# EAGLE design Dario - Rev A1 (EAGLE 7.6.0)
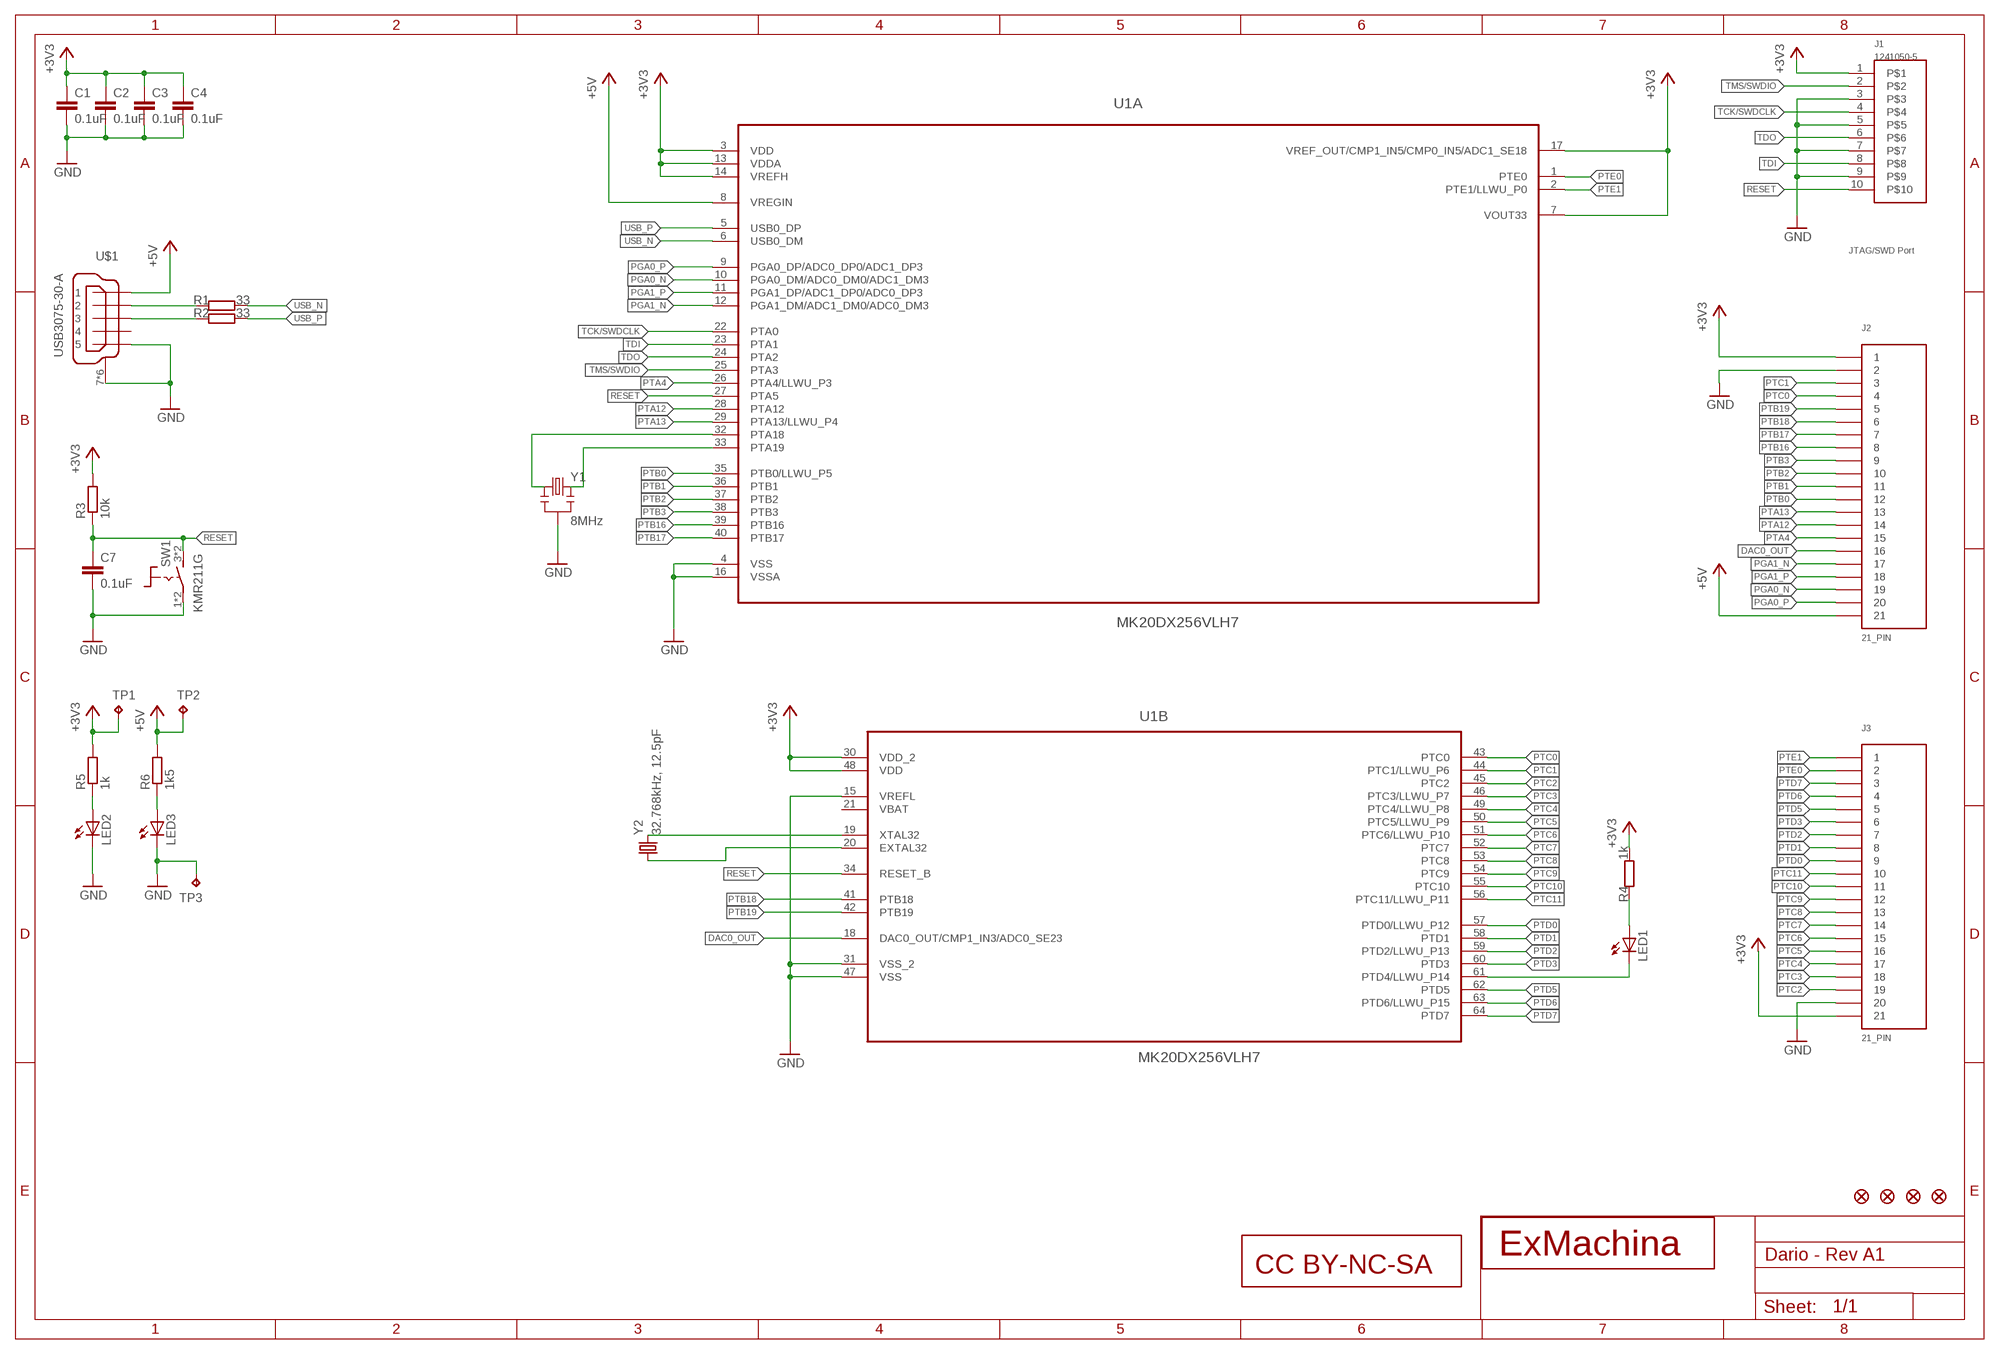
[diagram p0: schematic, sheet 1]

## Parts
C1  0.1uF  C-EUC0603  [C0603]
C2  0.1uF  C-EUC0603  [C0603]
C3  0.1uF  C-EUC0603  [C0603]
C4  0.1uF  C-EUC0603  [C0603]
C7  0.1uF  C-EUC0603  [C0603]
J1  1241050-5  [2.54/2X5]
J2  21_PIN  [21_CUSTOM]
J3  21_PIN  [21_CUSTOM]
JP1  FIDUCIAL1X2  [FIDUCIAL-1X2]
JP2  FIDUCIAL1X2  [FIDUCIAL-1X2]
JP3  FIDUCIAL1X2  [FIDUCIAL-1X2]
JP4  FIDUCIAL1X2  [FIDUCIAL-1X2]
LED1  LEDCHIP-LED0603  [CHIP-LED0603]
LED2  LEDCHIP-LED0603  [CHIP-LED0603]
LED3  LEDCHIP-LED0603  [CHIP-LED0603]
R1  33  R-EU_R0603  [R0603]
R2  33  R-EU_R0603  [R0603]
R3  10k  R-EU_R0603  [R0603]
R4  1k  R-EU_R0603  [R0603]
R5  1k  R-EU_R0603  [R0603]
R6  1k5  R-EU_R0603  [R0603]
SW1  KMR211G  [KM_SERIE]
TP1  TPB1,27  [B1,27]
TP2  TPB1,27  [B1,27]
TP3  TPB1,27  [B1,27]
U1  MK20DX256VLH7  [QFP50P1200X1200X160-64N]
U$1  USB3075-30-A  [USB_MICROB_SMT]
U$3  EXMACHINA-LOGO-NAME  [EXM-LOGO-BASELINE]
U$4  CC-BY-NC-SA  [CC-BY-NC-SA]
Y1  8MHz  RESONATORSMD  [RESONATOR-SMD]
Y2  32.768kHz, 12.5pF  ABS07-32.768KHZ  [ABS07]

## Nets
+3V3: C1.1 C2.1 C3.1 C4.1 J1.1 J2.P$1 J3.P$21 R3.2 R4.2 R5.2 TP1.TP U1.3(A:VDD) U1.7(A:VOUT33) U1.13(A:VDDA) U1.14(A:VREFH) U1.17(A:VREF_OUT/CMP1_IN5/CMP0_IN5/ADC1_SE18) U1.30(B:VDD_2) U1.48(B:VDD)
+5V: J2.P$21 R6.2 TP2.TP U1.8(A:VREGIN) U$1.1
DAC0_OUT: J2.P$16 U1.18(B:DAC0_OUT/CMP1_IN3/ADC0_SE23)
GND: C1.2 C2.2 C3.2 C4.2 C7.2 J1.3 J1.5 J1.7 J1.9 J2.P$2 J3.P$20 LED2.C LED3.C SW1.1 SW1.2 TP3.TP U1.4(A:VSS) U1.15(B:VREFL) U1.16(A:VSSA) U1.31(B:VSS_2) U1.47(B:VSS) U$1.5 U$1.7(S) U$1.8(S) U$1.9(S) U$1.10(S) U$1.11(S) U$1.12(S) Y1.2
N$1: R1.1 U$1.2
N$2: R2.1 U$1.3
N$3: U1.33(A:PTA19) Y1.3
N$4: U1.32(A:PTA18) Y1.1
N$5: U1.19(B:XTAL32) Y2.2
N$6: U1.20(B:EXTAL32) Y2.1
N$7: LED1.C U1.61(B:PTD4/LLWU_P14)
N$8: LED1.A R4.1
N$9: LED3.A R6.1
N$10: LED2.A R5.1
PGA0_N: J2.P$19 U1.10(A:PGA0_DM/ADC0_DM0/ADC1_DM3)
PGA0_P: J2.P$20 U1.9(A:PGA0_DP/ADC0_DP0/ADC1_DP3)
PGA1_N: J2.P$17 U1.12(A:PGA1_DM/ADC1_DM0/ADC0_DM3)
PGA1_P: J2.P$18 U1.11(A:PGA1_DP/ADC1_DP0/ADC0_DP3)
PTA4: J2.P$15 U1.26(A:PTA4/LLWU_P3)
PTA12: J2.P$14 U1.28(A:PTA12)
PTA13: J2.P$13 U1.29(A:PTA13/LLWU_P4)
PTB0: J2.P$12 U1.35(A:PTB0/LLWU_P5)
PTB1: J2.P$11 U1.36(A:PTB1)
PTB2: J2.P$10 U1.37(A:PTB2)
PTB3: J2.P$9 U1.38(A:PTB3)
PTB16: J2.P$8 U1.39(A:PTB16)
PTB17: J2.P$7 U1.40(A:PTB17)
PTB18: J2.P$6 U1.41(B:PTB18)
PTB19: J2.P$5 U1.42(B:PTB19)
PTC0: J2.P$4 U1.43(B:PTC0)
PTC1: J2.P$3 U1.44(B:PTC1/LLWU_P6)
PTC2: J3.P$19 U1.45(B:PTC2)
PTC3: J3.P$18 U1.46(B:PTC3/LLWU_P7)
PTC4: J3.P$17 U1.49(B:PTC4/LLWU_P8)
PTC5: J3.P$16 U1.50(B:PTC5/LLWU_P9)
PTC6: J3.P$15 U1.51(B:PTC6/LLWU_P10)
PTC7: J3.P$14 U1.52(B:PTC7)
PTC8: J3.P$13 U1.53(B:PTC8)
PTC9: J3.P$12 U1.54(B:PTC9)
PTC10: J3.P$11 U1.55(B:PTC10)
PTC11: J3.P$10 U1.56(B:PTC11/LLWU_P11)
PTD0: J3.P$9 U1.57(B:PTD0/LLWU_P12)
PTD1: J3.P$8 U1.58(B:PTD1)
PTD2: J3.P$7 U1.59(B:PTD2/LLWU_P13)
PTD3: J3.P$6 U1.60(B:PTD3)
PTD5: J3.P$5 U1.62(B:PTD5)
PTD6: J3.P$4 U1.63(B:PTD6/LLWU_P15)
PTD7: J3.P$3 U1.64(B:PTD7)
PTE0: J3.P$2 U1.1(A:PTE0)
PTE1: J3.P$1 U1.2(A:PTE1/LLWU_P0)
RESET: C7.1 J1.10 R3.1 SW1.3 SW1.4 U1.27(A:PTA5) U1.34(B:RESET_B)
TCK/SWDCLK: J1.4 U1.22(A:PTA0)
TDI: J1.8 U1.23(A:PTA1)
TDO: J1.6 U1.24(A:PTA2)
TMS/SWDIO: J1.2 U1.25(A:PTA3)
USB_N: R1.2 U1.6(A:USB0_DM)
USB_P: R2.2 U1.5(A:USB0_DP)
Unconnected: U$1.4

## Notes on the sheet
- JTAG/SWD Port

## Power pins joined to a net without a drawn wire
VBAT: U1.21(B:VBAT)

## Library data of the parts
C1-C4 C7 = rcl:C-EU: CAPACITOR, European symbol; MPN: MC0603B104K160CT; OC_NEWARK: 06R4923
J1 = con-amp:1241050-5; MPN: 1241050-5; OC_NEWARK: 98K5467
J2 J3 = con-custom:21_PIN; OC_NEWARK: unknown
JP1-JP4 = SparkFun:FIDUCIAL: Fiducial Alignment Points Various fiducial points for machine vision alignment.; OC_NEWARK: unknown
LED1-LED3 = led:LED: LED OSRAM: - CHIPLED LG R971, LG N971, LY N971, LG Q971, LY Q971, LO R971, LY R971 LH N974, LH R974 LS Q976, LO Q976, LY Q976 LO Q996 - Hyper CHIPLED LW Q18S LB Q993, LB Q99A, LB R99A - SideLED LS A670, LO A670, LY A670, LG A670, LP A670 LB A673, LV A673, LT A673, LW A673 LH A674 LY A675 LS A676, LA A676, LO A676, LY A676, LW A676 LS A679, LY A679, LG A679 - Hyper Micro SIDELED® LS Y876, LA Y876, LO Y876, LY Y876 LT Y87S - SmartLED LW L88C, LW L88S LB L89C, LB L89S, LG L890 LS L89K, LO L89K, LY L89K LS L896, LA L896, LO L896, LY L896 - TOPLED LS T670, LO T670, LY T670, LG T670, LP T670 LSG T670, LSP T670, LSY T670, LOP T670, LYG T670 LG T671, LOG T671, LSG T671 LB T673, LV T673, LT T673, LW T673 LH T674 LS T676, LA T676, LO T676, LY T676, LB T676, LH T676, LSB T676, LW T676 LB T67C, LV T67C, LT T67C, LS T67K, LO T67K, LY T67K, LW E67C LS E67B, LA E67B, LO E67B, LY E67B, LB E67C, LV E67C, LT E67C LW T67C LS T679, LY T679, LG T679 LS T770, LO T770, LY T770, LG T770, LP T770 LB T773, LV T773, LT T773, LW T773 LH T774 LS E675, LA E675, LY E675, LS T675 LS T776, LA T776, LO T776, LY T776, LB T776 LHGB T686 LT T68C, LB T68C - Hyper Mini TOPLED® LB M676 - Mini TOPLED Santana® LG M470 LS M47K, LO M47K, LY M47K Source: http://www.osram.convergy.de LUXEON: - LUMILED® LXK2-PW12-R00, LXK2-PW12-S00, LXK2-PW14-U00, LXK2-PW14-V00 LXK2-PM12-R00, LXK2-PM12-S00, LXK2-PM14-U00 LXK2-PE12-Q00, LXK2-PE12-R00, LXK2-PE12-S00, LXK2-PE14-T00, LXK2-PE14-U00 LXK2-PB12-K00, LXK2-PB12-L00, LXK2-PB12-M00, LXK2-PB14-N00, LXK2-PB14-P00, LXK2-PB14-Q00 LXK2-PR12-L00, LXK2-PR12-M00, LXK2-PR14-Q00, LXK2-PR14-R00 LXK2-PD12-Q00, LXK2-PD12-R00, LXK2-PD12-S00 LXK2-PH12-R00, LXK2-PH12-S00 LXK2-PL12-P00, LXK2-PL12-Q00, LXK2-PL12-R00 Source: www.luxeon.com KINGBRIGHT: KA-3528ASYC Source: www.kingbright.com; OC_NEWARK: unknown
R1 R2 = rcl:R-EU_: RESISTOR, European symbol; MPN: MCMR06X33R0FTL; OC_NEWARK: 86T3614
R3 = rcl:R-EU_: RESISTOR, European symbol; MPN: MCMR06X1002FTL; OC_NEWARK: 86T3506
R4 R5 = rcl:R-EU_: RESISTOR, European symbol; MPN: MCMR06X1001FTL; OC_NEWARK: 86T3505
R6 = rcl:R-EU_: RESISTOR, European symbol; MPN: MCMR06X1501FTL; OC_NEWARK: 86T3542
SW1 = Switch_SMT:KMR211G; MPN: KMR211G LFS; OC_NEWARK: 58M7852
TP1-TP3 = testpad:TP: Test pad; OC_NEWARK: unknown
U1 = freescale:MK20DX256VLH7: MCU, KINETIS, K20, CORTEX M4, LQFP-64; MPN: MK20DX256VLH7; OC_FARNELL: 2133577; OC_NEWARK: 24W6507; PACKAGE: LQFP-64; SUPPLIER: FREESCALE SEMICONDUCTOR
U$1 = con-GlobalConnectorTechnology:USB3075-30-A; MPN: USB3075-30-A; OC_NEWARK: 58T0863
U$3 = exmachina:EXMACHINA-LOGO; OC_NEWARK: unknown
U$4 = cc-by-sa:CC-BY-NC-SA; OC_NEWARK: unknown
Y1 = resonator:RESONATOR: Resonator Small SMD resonator. This is the itty bitty 10/20MHz resonators with built in caps. CSTCE10M0G55 and CSTCE20M0V53. Footprint for SMD has been used in SFE production for years, and does work okay. 1:1 is an attempt to get larger fillets on the sides so it will be easier to inspect these solders in our AOI machine. The pads have been minimized to match the actual metal under the resonator. To see this relation, it includes an image import of the bottom side of the component. Imported to scale on layer 200.; MPN: CSTCE8M00G55Z-R0; OC_NEWARK: 80P4001
Y2 = crystal:ABS07-?; MPN: ABS07-32.768KHZ-1-T; OC_FARNELL: 2101347; OC_NEWARK: 11N6974

## Board
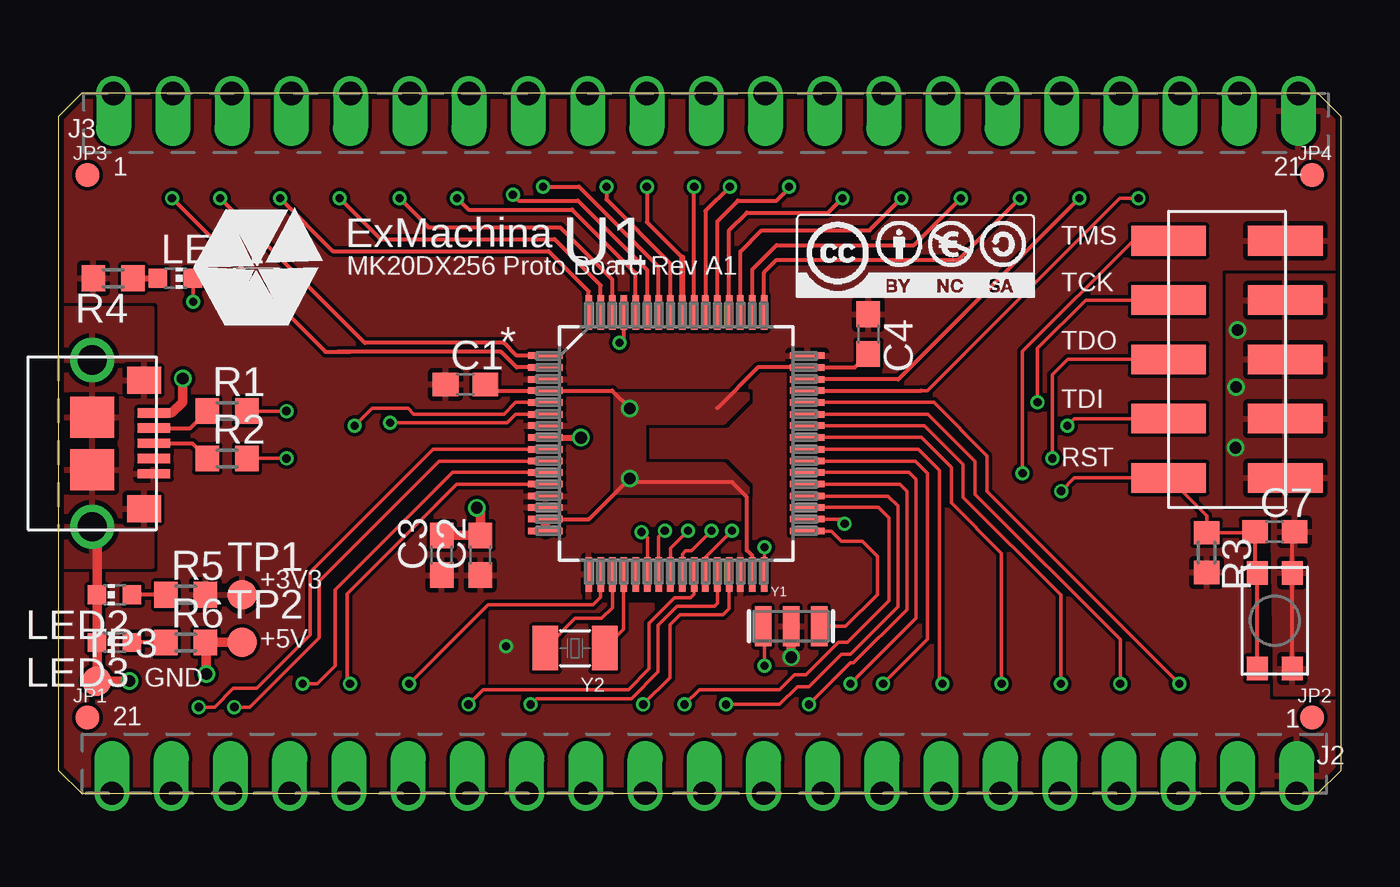
[diagram p1: board, top side]
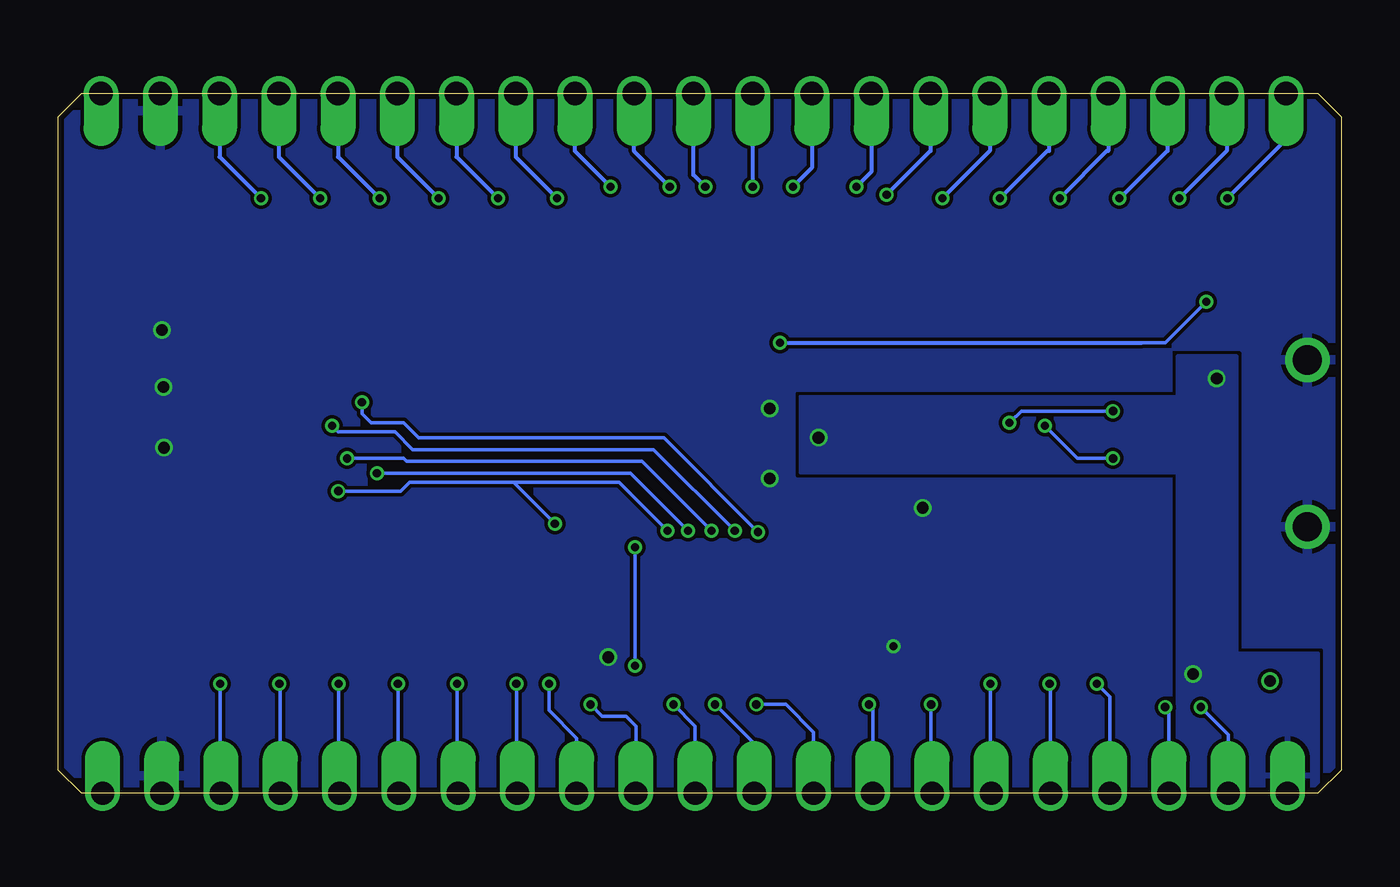
[diagram p2: board, bottom side, seen from below]

Size 55 x 30 mm. Coordinates in mm from the lower left corner, seen from the top.
Outline: 55,1 55,29 54,30 1,30 0,29 0,1 1,0 54,0 55,1
Copper layers (1*16): Top 0.018mm / dielectric 1.55mm / Bottom 0.018mm
Design rules "eC_2Layer_PClass6_BaseCopperO18_eCDefault *": minimum track width 0.15mm, minimum drill 0.35mm, track to track 0.15mm, track to pad 0.15mm, pad to pad 0.15mm, via to via 0.15mm, smd to smd 0mil, copper to edge 0.25mm, drill to drill 0.35mm, minimum pad ring 0.175mm, minimum via ring 0.125mm, stop-mask expansion 0mil, vias tented up to drill 0.45mm, thermal gap 0.2mm

### Footprints (pad centres in the part's own frame; a part is rotated, then mirrored left to right if it is on the bottom)
C0603 = smd 1.1 x 1: 1 -0.85,0; 2 0.85,0
2.54/2X5 = smd 1.27 x 3.2: 1 -5.08,2.5; 2 -5.08,-2.5; 3 -2.54,2.5; 4 -2.54,-2.5; 5 0,2.5; 6 0,-2.5; 7 2.54,2.5; 8 2.54,-2.5; 9 5.08,2.5; 10 5.08,-2.5
21_CUSTOM = drill 1 offset: P$1 -25.4,0; P$2 -22.86,0; P$3 -20.32,0; P$4 -17.78,0; P$5 -15.24,0; P$6 -12.7,0; P$7 -10.16,0; P$8 -7.62,0; P$9 -5.08,0; P$10 -2.54,0; P$11 0,0; P$12 2.54,0; P$13 5.08,0; P$14 7.62,0; P$15 10.16,0; P$16 12.7,0; P$17 15.24,0; P$18 17.78,0; P$19 20.32,0; P$20 22.86,0; P$21 25.4,0
FIDUCIAL-1X2 = smd 1 x 1: 1 0,0
CHIP-LED0603 = smd 0.8 x 0.8: A 0,-0.75; C 0,0.75
R0603 = smd 1 x 1.1: 1 -0.85,0; 2 0.85,0
KM_SERIE = smd 1 x 0.9: 1 -2.05,0.75; 2 2.05,0.75; 3 -2.05,-0.75; 4 2.05,-0.75
B1,27 = smd 1.27 x 1.27: TP 0,0
QFP50P1200X1200X160-64N = smd 1.473 x 0.279: 1 -5.613,3.759; 2 -5.613,3.251; 3 -5.613,2.743; 4 -5.613,2.261; 5 -5.613,1.753; 6 -5.613,1.245; 7 -5.613,0.762; 8 -5.613,0.254; 9 -5.613,-0.254; 10 -5.613,-0.762; 11 -5.613,-1.245; 12 -5.613,-1.753; 13 -5.613,-2.261; 14 -5.613,-2.743; 15 -5.613,-3.251; 16 -5.613,-3.759; 33 5.613,-3.759; 34 5.613,-3.251; 35 5.613,-2.743; 36 5.613,-2.261; 37 5.613,-1.753; 38 5.613,-1.245; 39 5.613,-0.762; 40 5.613,-0.254; 41 5.613,0.254; 42 5.613,0.762; 43 5.613,1.245; 44 5.613,1.753; 45 5.613,2.261; 46 5.613,2.743; 47 5.613,3.251; 48 5.613,3.759 | smd 0.279 x 1.473: 17 -3.759,-5.613; 18 -3.251,-5.613; 19 -2.743,-5.613; 20 -2.261,-5.613; 21 -1.753,-5.613; 22 -1.245,-5.613; 23 -0.762,-5.613; 24 -0.254,-5.613; 25 0.254,-5.613; 26 0.762,-5.613; 27 1.245,-5.613; 28 1.753,-5.613; 29 2.261,-5.613; 30 2.743,-5.613; 31 3.251,-5.613; 32 3.759,-5.613; 49 3.759,5.613; 50 3.251,5.613; 51 2.743,5.613; 52 2.261,5.613; 53 1.753,5.613; 54 1.245,5.613; 55 0.762,5.613; 56 0.254,5.613; 57 -0.254,5.613; 58 -0.762,5.613; 59 -1.245,5.613; 60 -1.753,5.613; 61 -2.261,5.613; 62 -2.743,5.613; 63 -3.251,5.613; 64 -3.759,5.613
USB_MICROB_SMT = smd 0.4 x 1.4: 1 -1.3,2.65; 2 -0.65,2.65; 3 0,2.65; 4 0.65,2.65; 5 1.3,2.65 | smd 1.15 x 1.45: 7 -2.7,2.23; 8 2.8,2.23 | smd 1.75 x 1.9: 9 -1.125,0; 10 1.125,0 | drill 1.25 pad 1.9: 11 -3.575,0; 12 3.575,0
RESONATOR-SMD = smd 0.7 x 1.7: 1 -1.2,0; 2 0,0; 3 1.2,0
ABS07 = smd 1.092 x 1.905: 1 -1.27,0; 2 1.27,0

### Placement (x,y rotation side)
C1  17.45,17.53 0 top
C2  18.1,10.21 90 top
C3  16.44,10.21 90 top
C4  34.73,19.68 270 top
C7  52.15,11.21 0 top
J1  50.1,18.6 270 top
J2  27.7,0 180 top
J3  27.77,30 0 top
JP1  1.25,3.25 0 top
JP2  53.75,3.25 0 top
JP3  1.25,26.5 0 top
JP4  53.75,26.5 0 top
LED1  5.03,22.07 270 top
LED2  2.41,8.51 90 top
LED3  2.41,6.47 90 top
R1  7.24,16.38 0 top
R2  7.24,14.35 0 top
R3  49.23,10.32 270 top
R4  2.35,22.07 180 top
R5  5.46,8.51 0 top
R6  5.46,6.47 0 top
SW1  52.15,7.4 270 top
TP1  7.87,8.51 0 top
TP2  7.87,6.47 0 top
TP3  1.65,4.81 0 top
U1  26.5,15 0 top
U$1  1.45,15 270 top
U$3  8.49,22.52 0 top
U$4  36.75,23 0 top
Y1  31.42,7.16 0 top
Y2  22.15,6.22 180 top

### Tracks (layer width: path | path; a pad name or v marks a point on that pad's centre or on a via)
+3V3
  pour Top (rank 3): 0,30 55,30 55,0 0,0
+5V  (via drill 0.5)
  Top 0.254: U1.8 v22.41,15.24
  Top 0.406: TP2.TP R6.2 6.35,6.51 v6.35,5.11 | U$1.1 4.87,16.3 5.33,16.76 v5.33,17.78
  pour Bottom: 1,0 7,0 7,13.75 23.17,13.75 23.17,17 7,17 7,18.75 4.5,18.75 4.5,6 1,6
DAC0_OUT  (via drill 0.35)
  Top 0.15: U1.18 23.25,8.41 22.92,8.07 18.42,8.07 v15.04,4.7
  Bottom 0.15: v15.04,4.7 15.04,0.03 15.01,0 J2.P$16
GND  (via drill 0.35, 0.5)
  Top 0.178: 28.25,16.51 29.99,18.25 U1.47 34.14,18.25 C4.2 | v24.5,16.5 23.74,17.26 U1.4 18.57,17.26 C1.2 | SW1.2 SW1.1 52.9,11.11 C7.2 | U1.15 22.75,11.75 v24.5,13.5 24.66,13.34 28.89,13.34 29.52,12.7 29.52,10.41 29.75,10.18 U1.31
  Top 0.406: U1.15 U1.16 | Y1.2 v31.42,5.83 | 16.44,11.43 C3.2 C2.2 18.1,12.09 v17.95,12.24 | v3.05,4.81 TP3.TP 1.66,4.82 LED3.C LED2.C 1.66,11.21 U$1.12
  other vias: 50.48,14.81 50.49,17.41 50.56,19.86 19.2,6.3
  pour Bottom (rank 3): 0,30 55,30 55,0 0,0
  pour Top: 0,20.75 0,9.75 4,9.75 4,20.75
  pour Top: 29.5,13 24,13 24,17 29.5,17 28.5,16 25,16 25,14 28.5,14
  pour Top: 50.11,12.35 50.11,22.2 54.94,22.2 54.94,4.22 52.15,4.22 52.02,12.35
  pour Top: 29.7,7.6 29.7,5.5 32.5,5.5 32.5,7.6
  pour Top: 18.5,8.1 25.5,8.1 25.5,4.4 18.5,4.4
N$1
  Top 0.178: U$1.2 5.66,15.65 R1.1
N$2
  Top 0.178: U$1.3 5.74,15 R2.1
N$3
  Top 0.15: U1.33 33.14,11.24 33.58,10.79 34.47,10.79 35.11,10.16 35.11,8.51 33.76,7.16 Y1.3
N$4  (via drill 0.35)
  Top 0.15: U1.32 30.28,9.41 v30.28,10.54 | Y1.1 30.26,7.2 30.28,7.2 30.27,7.19 v30.27,5.46
  Bottom 0.15: v30.28,10.54 30.28,5.47 v30.27,5.46
N$5
  Top 0.15: Y2.2 22.15,7.49 23.3,7.49 23.76,7.95 U1.19
N$6
  Top 0.15: Y2.1 24.24,7.04 U1.20
N$7  (via drill 0.35)
  Top 0.15: LED1.C v5.78,21.07
  Top 0.178: U1.61 24.24,19.48 v24.06,19.3
  Bottom 0.15: v5.78,21.07 7.55,19.3 8.58,19.3
  Bottom 0.178: v24.06,19.3 8.58,19.3
N$8
  Top 0.254: R4.1 LED1.A
N$9
  Top 0.178: R6.1 LED3.A
N$10
  Top 0.178: R5.1 LED2.A
PGA0_N  (via drill 0.35)
  Top 0.15: U1.10 16.33,14.24 11.18,9.09 11.18,6.68 8.2,3.7 v7.55,3.7
  Bottom 0.15: 7.45,3.6 v7.55,3.7 7.38,3.53 J2.P$19
PGA0_P  (via drill 0.35)
  Top 0.15: U1.9 16.07,14.75 10.79,9.47 10.79,6.79 8.5,4.5 7.5,4.5 6.7,3.7 v6.03,3.7
  Bottom 0.15: v6.03,3.7 4.84,2.51 J2.P$20
PGA1_N  (via drill 0.35)
  Top 0.15: U1.12 17.07,13.25 12.38,8.55 12.38,4.83 v12.5,4.7
  Bottom 0.15: v12.5,4.7 12.53,4.67 12.46,4.6 J2.P$17
PGA1_P  (via drill 0.35)
  Top 0.15: U1.11 16.9,13.76 11.87,8.72 11.87,5.46 11.11,4.7 v10.47,4.7
  Bottom 0.15: v10.47,4.7 9.92,4.15 J2.P$18
PTA4  (via drill 0.35)
  Top 0.15: U1.26 27.26,8.54 27.11,8.38 26.42,8.38 25.33,7.29 25.33,5.33 24.44,4.45 18.22,4.45 v17.58,3.81
  Bottom 0.15: v17.58,3.81 17.58,0.03 17.55,0 J2.P$15
PTA12  (via drill 0.35)
  Top 0.15: U1.28 28.25,8.15 28.13,8.03 26.53,8.03 25.71,7.21 25.71,5.21 24.57,4.06 20.5,4.06 v20.25,3.81
  Bottom 0.15: 20.15,3.71 v20.25,3.81 20.08,3.64 J2.P$14
PTA13  (via drill 0.35)
  Top 0.15: U1.29 28.76,7.9 28.5,7.65 26.65,7.65 26.22,7.22 26.22,4.95 v25.07,3.81
  Bottom 0.15: v25.07,3.81 23.8,3.81 22.62,2.62 J2.P$13
PTB0  (via drill 0.35)
  Top 0.15: U1.35 35.17,12.26 35.62,11.81 35.62,8.26 33.84,6.48 33.46,6.48 32.06,5.08 31.55,5.08 30.92,4.45 27.49,4.45 v26.85,3.81
  Bottom 0.15: v26.85,3.81 25.16,2.12 J2.P$12
PTB1  (via drill 0.35)
  Top 0.15: U1.36 35.58,12.74 36,12.32 36,8 33.97,5.97 33.58,5.97 32.19,4.57 31.68,4.57 30.92,3.81 v28.63,3.81
  Bottom 0.15: v28.63,3.81 27.7,2.88 J2.P$11
PTB2  (via drill 0.35)
  Top 0.15: U1.37 36.09,13.25 36.38,12.95 36.38,7.87 34.09,5.59 33.97,5.59 v32.19,3.81
  Bottom 0.15: v32.19,3.81 31.68,3.3 30.66,3.3 30.24,2.88 J2.P$10
PTB3  (via drill 0.35)
  Top 0.15: U1.38 36.47,13.76 36.76,13.46 36.76,7.49 v33.97,4.7
  Bottom 0.15: v33.97,4.7 33.97,3.56 32.78,2.37 J2.P$9
PTB16  (via drill 0.35)
  Top 0.15: v35.36,4.7 37.27,6.6 37.27,13.72 36.74,14.24 U1.39
  Bottom 0.15: v35.36,4.7 35.36,0.03 35.33,0 J2.P$8
PTB17  (via drill 0.35)
  Top 0.15: U1.40 36.87,14.75 37.77,13.84 37.77,4.83 v37.9,4.7
  Bottom 0.15: v37.9,4.7 37.9,0.03 37.87,0 J2.P$7
PTB18  (via drill 0.35)
  Top 0.15: U1.41 37,15.25 38.28,13.97 38.28,12.45 40.44,10.29 v40.44,4.7
  Bottom 0.15: v40.44,4.7 40.44,0.03 40.41,0 J2.P$6
PTB19  (via drill 0.35)
  Top 0.15: U1.42 37.13,15.76 38.79,14.1 38.79,12.7 42.98,8.51 v42.98,4.7
  Bottom 0.15: v42.98,4.7 42.98,0.03 42.95,0 J2.P$5
PTC0  (via drill 0.35)
  Top 0.15: U1.43 37.28,16.25 39.3,14.22 39.3,12.83 45.52,6.6 v45.52,4.7
  Bottom 0.15: v45.52,4.7 45.55,4.67 45.48,4.6 J2.P$4
PTC1  (via drill 0.35)
  Top 0.15: U1.44 37.53,16.75 39.81,14.48 39.81,12.95 v48.06,4.7
  Bottom 0.15: v48.06,4.7 48.06,0.03 48.05,0.03 J2.P$3
PTC2  (via drill 0.35)
  Top 0.15: v46.31,25.5 45.5,25.5 37.26,17.26 37,17.26
  Top 0.178: U1.45 37,17.26
  Bottom 0.178: J3.P$19 48.09,27.28 v46.31,25.5
PTC3  (via drill 0.35)
  Top 0.178: v43.77,25.5 36.02,17.74 U1.46
  Bottom 0.178: J3.P$18 45.55,27.28 v43.77,25.5
PTC4  (via drill 0.35)
  Top 0.178: v41.23,25.5 38.59,22.86 30.79,22.86 30.26,22.33 U1.49
  Bottom 0.178: J3.P$17 43.01,27.28 v41.23,25.5
PTC5  (via drill 0.35)
  Top 0.178: v38.69,25.5 36.69,23.5 30.79,23.5 29.75,22.46 U1.50
  Bottom 0.178: J3.P$16 40.47,27.28 v38.69,25.5
PTC6  (via drill 0.35)
  Top 0.178: v36.15,25.5 34.78,24.13 30.16,24.13 29.24,23.22 U1.51
  Bottom 0.178: J3.P$15 37.93,27.28 v36.15,25.5
PTC7  (via drill 0.35)
  Top 0.178: v33.61,25.5 33,24.89 29.52,24.89 28.76,24.13 U1.52
  Bottom 0.178: J3.P$14 35.39,27.28 v33.61,25.5
PTC8  (via drill 0.35)
  Top 0.178: U1.53 28.25,24.51 29.14,25.4 30.79,25.4 31.33,25.94 v31.33,26
  Bottom 0.178: v31.33,26 32.85,27.52 J3.P$13
PTC9  (via drill 0.35)
  Top 0.178: v28.79,26 27.75,24.96 U1.54
  Bottom 0.178: v28.79,26 30.31,27.52 J3.P$12
PTC10  (via drill 0.35)
  Top 0.178: U1.55 v27.26,26
  Bottom 0.178: v27.26,26 27.77,26.51 J3.P$11
PTC11  (via drill 0.35)
  Top 0.178: v25.23,26 25.23,24.48 26.75,22.96
  Top 0.254: U1.56 26.75,22.96
  Bottom 0.178: J3.P$10 v25.23,26
PTD0  (via drill 0.35)
  Top 0.178: U1.57 26.25,22.7 23.5,25.45 v23.5,26
  Bottom 0.178: J3.P$9 22.69,26.81 v23.5,26
PTD1  (via drill 0.35)
  Top 0.178: U1.58 25.74,22.58 22.32,26 v20.79,26
  Bottom 0.178: J3.P$8 20.15,26.64 v20.79,26
PTD2  (via drill 0.35)
  Top 0.178: U1.59 25.25,22.43 22.28,25.4 19.74,25.4 v19.49,25.65
  Bottom 0.178: J3.P$7 17.61,27.53 v19.49,25.65
PTD3  (via drill 0.35)
  Top 0.178: U1.60 24.75,22.3 22.03,25.02 17.58,25.02 v17.1,25.5
  Bottom 0.178: J3.P$6 15.07,27.53 v17.1,25.5
PTD5  (via drill 0.35)
  Top 0.178: U1.62 23.76,22.02 21.52,24.26 15.87,24.26 v14.63,25.5
  Bottom 0.178: J3.P$5 12.53,27.53 12.6,27.53 v14.63,25.5
PTD6  (via drill 0.35)
  Top 0.178: U1.63 23.25,21.77 21.27,23.75 13.82,23.75 v12.07,25.5
  Bottom 0.178: J3.P$4 9.99,27.53 10.04,27.53 v12.07,25.5
PTD7  (via drill 0.35)
  Top 0.178: U1.64 22.74,21.51 21.01,23.24 11.76,23.24 v9.5,25.5
  Bottom 0.178: J3.P$3 7.45,27.53 9.48,25.5 v9.5,25.5
PTE0  (via drill 0.35)
  Top 0.178: v6.94,25.5 12.57,19.88 13.14,19.3 19.11,19.3 19.65,18.76 U1.1
  Bottom 0.178: J3.P$2 4.91,27.53 v6.94,25.5
PTE1  (via drill 0.35)
  Top 0.178: U1.2 19.65,18.25 18.98,18.92 12.5,18.92 | 12.5,18.92 11.95,18.92 | v4.87,25.5 11.45,18.92 12.5,18.92
  Bottom 0.178: v4.87,25.5 2.37,28 J3.P$1
RESET  (via drill 0.35)
  Top 0.15: C7.1 51.26,11.17 R3.1 49.23,11.89 J1.10 43.56,13.52 v42.99,12.95 | v33.71,11.56 33.52,11.75 U1.34 | v28.89,11.26 27.75,10.12 U1.27
  Top 0.178: SW1.4 SW1.3 51.3,9.55 C7.1
  Bottom 0.15: v33.71,11.56 35.49,13.34 | 35.49,13.34 39.93,13.34 40.31,12.95 v42.99,12.95 | 35.49,13.34 30.96,13.34 v28.89,11.26
TCK/SWDCLK  (via drill 0.35)
  Top 0.15: U1.22 25.25,10.95 v25,11.2 | v41.98,16.76 41.98,19.08 44.05,21.14 J1.4
  Bottom 0.15: v41.98,16.76 41.98,16.26 41.6,15.88 40.19,15.88 39.55,15.24 29.04,15.24 v25,11.2
TDI  (via drill 0.35)
  Top 0.15: U1.23 25.74,10.99 v26,11.26 | J1.8 43.57,16.06 v43.26,15.75
  Bottom 0.15: v43.26,15.75 43,15.49 40.57,15.49 39.81,14.73 29.48,14.73 v26,11.26
TDO  (via drill 0.35)
  Top 0.15: U1.24 26.25,10.5 v27,11.26 | v42.61,14.35 42.61,17.94 43.27,18.6 J1.6
  Bottom 0.15: v42.61,14.35 40.19,14.35 40.06,14.22 29.97,14.22 v27,11.26
TMS/SWDIO  (via drill 0.35)
  Top 0.15: U1.25 26.75,10.25 26.9,10.4 27.14,10.4 v28,11.26 | v41.34,13.72 41.34,18.94 46.08,23.68 J1.2
  Top 0.178: 26.73,9.36 U1.25
  Bottom 0.15: v41.34,13.72 30.46,13.72 v28,11.26
USB_N  (via drill 0.35)
  Top 0.15: R1.2 v9.78,16.38 | U1.6 19.6,16.25 19.23,15.88 v14.22,15.88
  Bottom 0.15: 13.97,16.13 v14.22,15.88 13.72,16.38 v9.78,16.38
USB_P  (via drill 0.35)
  Top 0.15: R2.2 v9.78,14.35 | v12.7,15.75 13.46,16.51 14.99,16.51 15.24,16.26 19.11,16.26 19.61,16.76 20.88,16.76 U1.5
  Bottom 0.15: v9.78,14.35 11.3,14.35 v12.7,15.75

### Text on the board
tPlace: J3 | 1 | 21 | TMS | MK20DX256 Proto Board Rev A1 | TCK | TDO | TDI | RST | +3V3 | +5V | GND | 21 | 1 | J2